# EAGLE design untitled (EAGLE 6.1)
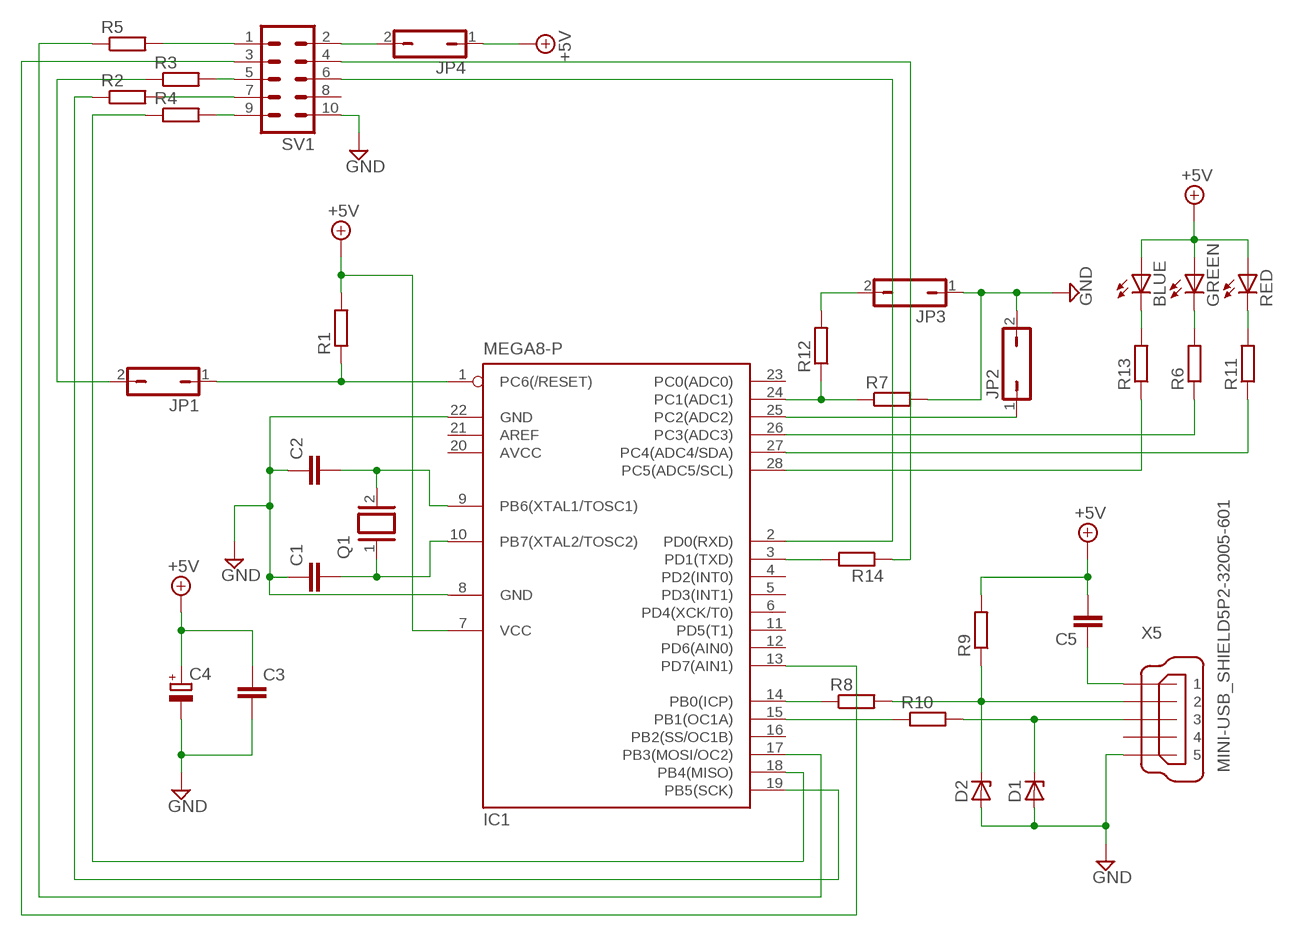
[diagram p0: schematic, sheet 1]

## Parts
BLUE  LED5MM  [LED5MM]
C1  C-EU025-025X050  [C025-025X050]
C2  C-EU025-025X050  [C025-025X050]
C3  C-EU025_050-025X075  [C025_050-025X075]
C4  CPOL-EUE2.5-5  [E2,5-5]
C5  C-EU025_050-025X075  [C025_050-025X075]
D1  ZENER-DIODEZD-5  [ZDIO-5]
D2  ZENER-DIODEZD-2.5  [ZDIO-2.5]
GREEN  LED5MM  [LED5MM]
IC1  MEGA8-P  [DIL28-3]
JP1  JP1Q  [JP1]
JP2  JP1Q  [JP1]
JP3  JP1Q  [JP1]
JP4  JP1Q  [JP1]
Q1  XTAL/S  [QS]
R1  R-EU_0207/2V  [0207/2V]
R2  R-EU_0207/2V  [0207/2V]
R3  R-EU_0207/2V  [0207/2V]
R4  R-EU_0207/2V  [0207/2V]
R5  R-EU_0207/2V  [0207/2V]
R6  R-EU_0204/5  [0204/5]
R7  R-EU_0204/5  [0204/5]
R8  R-EU_0207/2V  [0207/2V]
R9  R-EU_0207/2V  [0207/2V]
R10  R-EU_0207/2V  [0207/2V]
R11  R-EU_0204/5  [0204/5]
R12  R-EU_0204/5  [0204/5]
R13  R-EU_0204/5  [0204/5]
R14  R-EU_0207/2V  [0207/2V]
RED  LED5MM  [LED5MM]
SV1  ML10  [ML10]
X5  MINI-USB_SHIELD5P2-32005-601  [32005-601]

## Nets
+5V: BLUE.A C3.1 C4.+ C5.2 GREEN.A IC1.7(VCC) JP4.1 R1.2 R9.2 RED.A
D+: D1.C R10.2 X5.3
D-: D2.C R8.2 R9.1 X5.2
GND: C1.1 C2.1 C3.2 C4.- D1.A D2.A IC1.8(GND) IC1.22(GND) JP2.2 JP3.1 R7.2 SV1.10 X5.5
MISO: IC1.18(PB4(MISO)) R4.1
MOSI: IC1.17(PB3(MOSI/OC2)) R5.1
N$1: IC1.14(PB0(ICP)) R8.1
N$2: IC1.15(PB1(OC1A)) R10.1
N$3: IC1.24(PC1(ADC1)) R7.1 R12.1
N$4: JP3.2 R12.2
N$5: IC1.25(PC2(ADC2)) JP2.1
N$6: C5.1 X5.1
N$7: C2.2 IC1.9(PB6(XTAL1/TOSC1)) Q1.2
N$8: C1.2 IC1.10(PB7(XTAL2/TOSC2)) Q1.1
N$9: IC1.13(PD7(AIN1)) SV1.3
N$10: BLUE.K(C) R13.2
N$11: JP4.2 SV1.2
N$12: R11.2 RED.K(C)
N$13: R5.2 SV1.1
N$14: R3.2 SV1.5
N$15: R2.2 SV1.7
N$16: R4.2 SV1.9
N$17: IC1.3(PD1(TXD)) R14.2
N$19: GREEN.K(C) R6.2
N$20: JP1.2 R3.1
N$23: IC1.28(PC5(ADC5/SCL)) R13.1
N$24: IC1.26(PC3(ADC3)) R6.1
N$25: IC1.27(PC4(ADC4/SDA)) R11.1
RESET: IC1.1(PC6(/RESET)) JP1.1 R1.1
RX: IC1.2(PD0(RXD)) SV1.6
SCK: IC1.19(PB5(SCK)) R2.1
TX: R14.1 SV1.4
Unconnected: IC1.4(PD2(INT0)) IC1.5(PD3(INT1)) IC1.6(PD4(XCK/T0)) IC1.11(PD5(T1)) IC1.12(PD6(AIN0)) IC1.16(PB2(SS/OC1B)) IC1.21(AREF) IC1.23(PC0(ADC0)) SV1.8 X5.4 X5.M1(S1) X5.M2(S2)

## Power pins joined to a net without a drawn wire
AVCC: IC1.20(AVCC)

## Library data of the parts
BLUE GREEN RED = led:LED: LED OSRAM: - CHIPLED LG R971, LG N971, LY N971, LG Q971, LY Q971, LO R971, LY R971 LH N974, LH R974 LS Q976, LO Q976, LY Q976 LO Q996 - Hyper CHIPLED LW Q18S LB Q993, LB Q99A, LB R99A - SideLED LS A670, LO A670, LY A670, LG A670, LP A670 LB A673, LV A673, LT A673, LW A673 LH A674 LY A675 LS A676, LA A676, LO A676, LY A676, LW A676 LS A679, LY A679, LG A679 - Hyper Micro SIDELED® LS Y876, LA Y876, LO Y876, LY Y876 LT Y87S - SmartLED LW L88C, LW L88S LB L89C, LB L89S, LG L890 LS L89K, LO L89K, LY L89K LS L896, LA L896, LO L896, LY L896 - TOPLED LS T670, LO T670, LY T670, LG T670, LP T670 LSG T670, LSP T670, LSY T670, LOP T670, LYG T670 LG T671, LOG T671, LSG T671 LB T673, LV T673, LT T673, LW T673 LH T674 LS T676, LA T676, LO T676, LY T676, LB T676, LH T676, LSB T676, LW T676 LB T67C, LV T67C, LT T67C, LS T67K, LO T67K, LY T67K, LW E67C LS E67B, LA E67B, LO E67B, LY E67B, LB E67C, LV E67C, LT E67C LW T67C LS T679, LY T679, LG T679 LS T770, LO T770, LY T770, LG T770, LP T770 LB T773, LV T773, LT T773, LW T773 LH T774 LS E675, LA E675, LY E675, LS T675 LS T776, LA T776, LO T776, LY T776, LB T776 LHGB T686 LT T68C, LB T68C - Hyper Mini TOPLED® LB M676 - Mini TOPLED Santana® LG M470 LS M47K, LO M47K, LY M47K Source: http://www.osram.convergy.de LUXEON: - LUMILED® LXK2-PW12-R00, LXK2-PW12-S00, LXK2-PW14-U00, LXK2-PW14-V00 LXK2-PM12-R00, LXK2-PM12-S00, LXK2-PM14-U00 LXK2-PE12-Q00, LXK2-PE12-R00, LXK2-PE12-S00, LXK2-PE14-T00, LXK2-PE14-U00 LXK2-PB12-K00, LXK2-PB12-L00, LXK2-PB12-M00, LXK2-PB14-N00, LXK2-PB14-P00, LXK2-PB14-Q00 LXK2-PR12-L00, LXK2-PR12-M00, LXK2-PR14-Q00, LXK2-PR14-R00 LXK2-PD12-Q00, LXK2-PD12-R00, LXK2-PD12-S00 LXK2-PH12-R00, LXK2-PH12-S00 LXK2-PL12-P00, LXK2-PL12-Q00, LXK2-PL12-R00 Source: www.luxeon.com KINGBRIGHT: KA-3528ASYC Source: www.kingbright.com
C1-C3 C5 = rcl:C-EU: CAPACITOR, European symbol
C4 = rcl:CPOL-EU: POLARIZED CAPACITOR, European symbol
D1 D2 = diode:ZENER-DIODE: Z-Diode
IC1 = atmel:MEGA8-P: MICROCONTROLLER 8 Kbytes FLASH, 1 kbytes SRAM, 512 bytes EEPROM, USART, 4-channel 10 bit ADC, 2-channel 8 bit ADC Pin compatible with Atmega48, ATMega88, ATMega168 Source: avr.lbr; OC_FARNELL: unknown; OC_NEWARK: unknown
JP1-JP4 = jumper:JP1Q: JUMPER
Q1 = special:XTAL/S: CRYSTAL
R1-R14 = rcl:R-EU_: RESISTOR, European symbol
SV1 = con-ml:ML10: HARTING; OC_FARNELL: unknown; OC_NEWARK: unknown
X5 = con-cypressindustries:MINI-USB_SHIELD5P2-: MINI USB-B R/A DIP 5pol. Source: www.cypressindustries.com; OC_FARNELL: unknown; OC_NEWARK: unknown

## Board
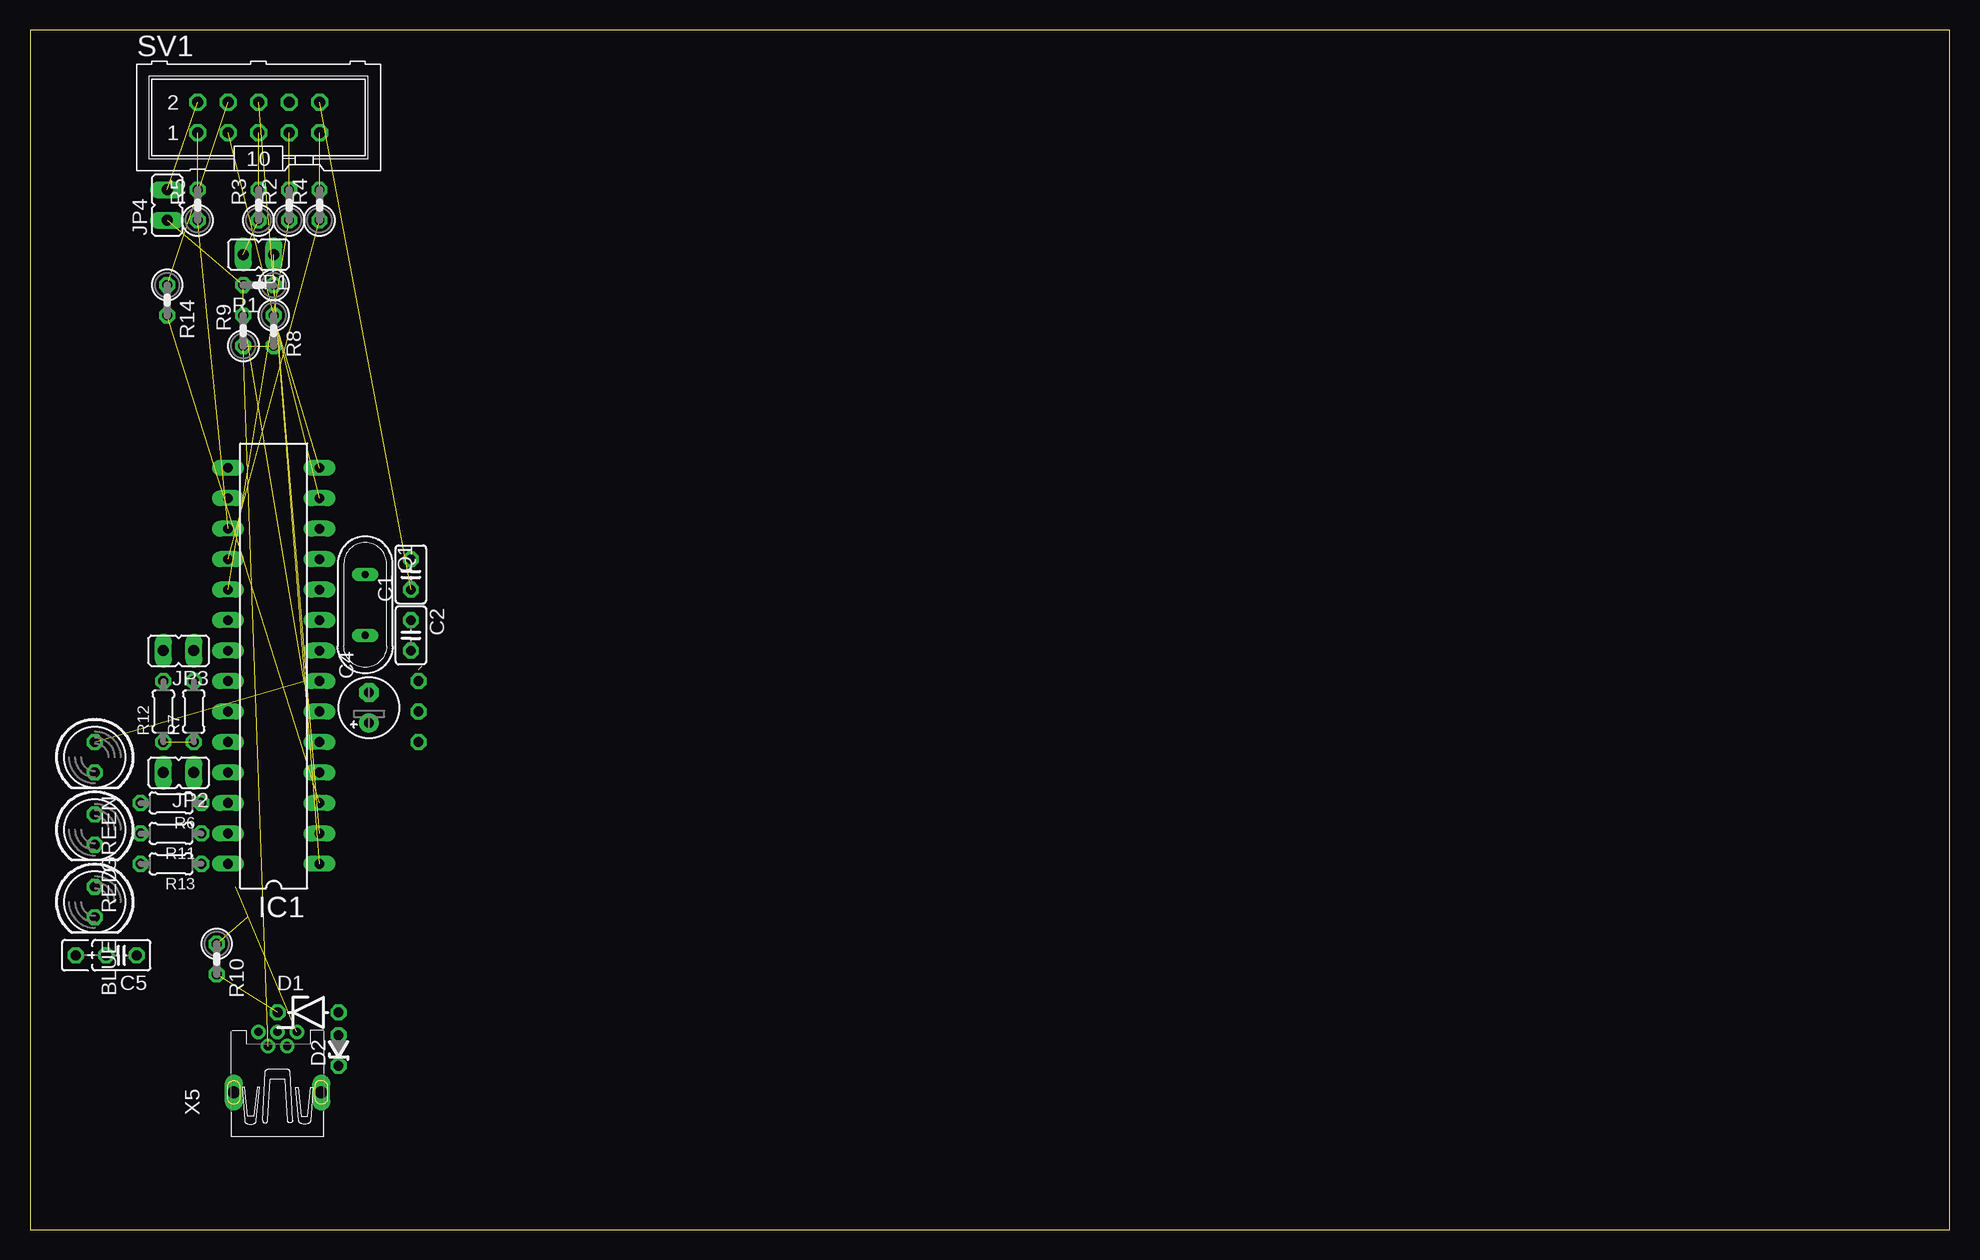
[diagram p1: board, top side]
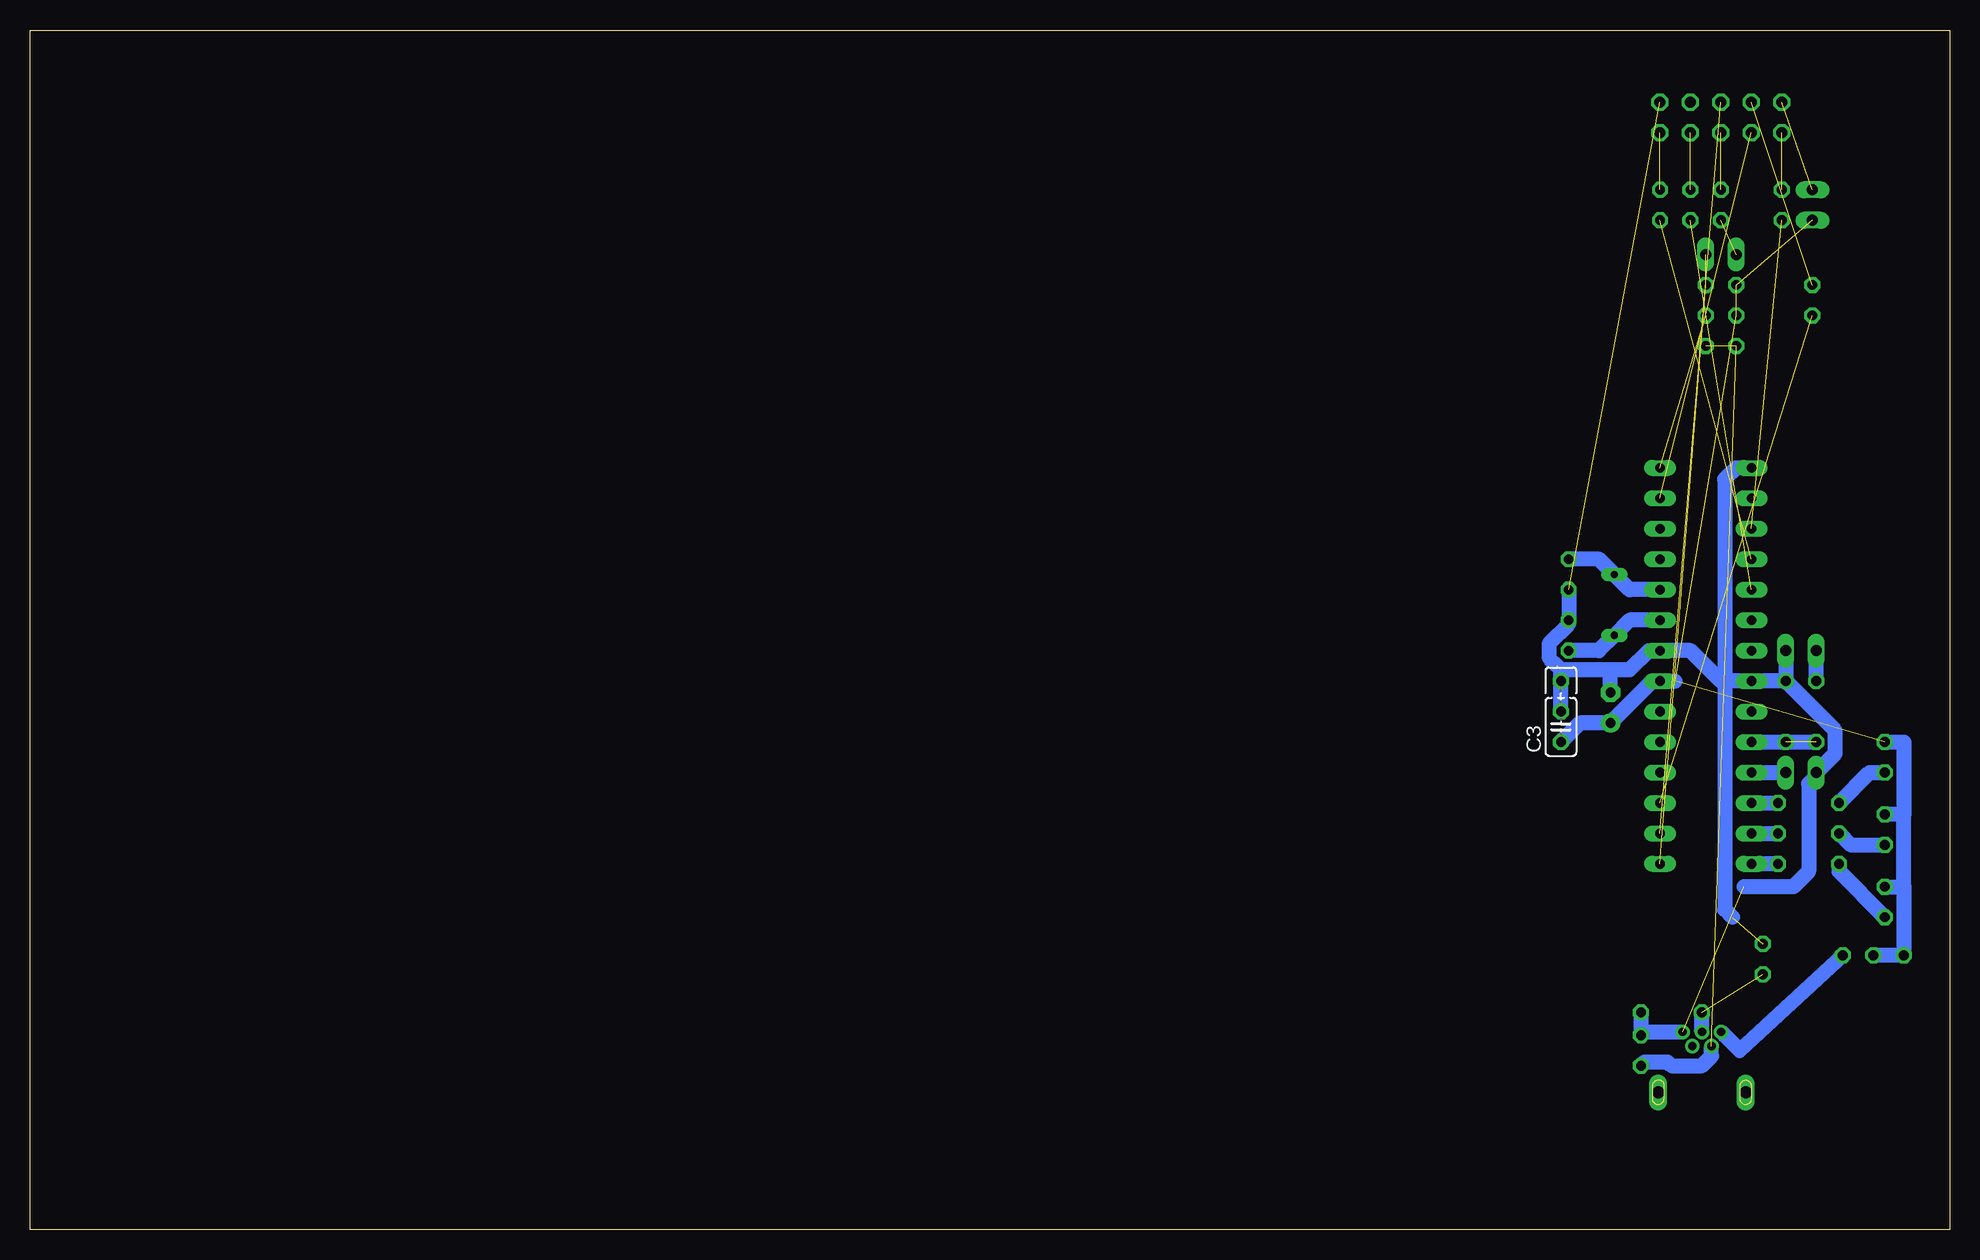
[diagram p2: board, bottom side, seen from below]

Size 160 x 100 mm. Coordinates in mm from the lower left corner, seen from the top.
Outline: 0,0 160,0 160,100 0,100 0,0
Copper layers (1*16): Top 0.035mm / dielectric 1.5mm / Bottom 0.035mm
Design rules: minimum track width 10mil, minimum drill 24mil, track to track 8mil, track to pad 8mil, pad to pad 8mil, via to via 8mil, smd to smd 8mil, copper to edge 40mil, drill to drill 8mil, minimum pad ring 10mil, minimum via ring 8mil, stop-mask expansion 4mil, vias tented up to drill 0mil, thermal gap 10mil

### Footprints (pad centres in the part's own frame; a part is rotated, then mirrored left to right if it is on the bottom)
LED5MM = drill 0.813 octagon: A -1.27,0; K 1.27,0
C025-025X050 = drill 0.813 octagon: 1 -1.27,0; 2 1.27,0
C025_050-025X075 = drill 0.813 octagon: 1 -1.27,0; 2 1.27,0; 3 3.81,0
E2,5-5 = drill 0.813 pad 1.6: + -1.27,0 | drill 0.813 pad 1.6 octagon: - 1.27,0
ZDIO-5 = drill 0.813 octagon: A 2.54,0; C -2.54,0
ZDIO-2.5 = drill 0.813 octagon: A 1.27,0; C -1.27,0
DIL28-3 = drill 0.813 long: 1 -16.51,-3.81; 2 -13.97,-3.81; 3 -11.43,-3.81; 4 -8.89,-3.81; 5 -6.35,-3.81; 6 -3.81,-3.81; 7 -1.27,-3.81; 8 1.27,-3.81; 9 3.81,-3.81; 10 6.35,-3.81; 11 8.89,-3.81; 12 11.43,-3.81; 13 13.97,-3.81; 14 16.51,-3.81; 15 16.51,3.81; 16 13.97,3.81; 17 11.43,3.81; 18 8.89,3.81; 19 6.35,3.81; 20 3.81,3.81; 21 1.27,3.81; 22 -1.27,3.81; 23 -3.81,3.81; 24 -6.35,3.81; 25 -8.89,3.81; 26 -11.43,3.81; 27 -13.97,3.81; 28 -16.51,3.81
JP1 = drill 0.914 long: 1 0,-1.27; 2 0,1.27
QS = drill 0.61 long: 1 -2.54,0; 2 2.54,0
0207/2V = drill 0.813 octagon: 1 -1.27,0; 2 1.27,0
0204/5 = drill 0.813 octagon: 1 -2.54,0; 2 2.54,0
ML10 = drill 0.914 octagon: 1 -5.08,-1.27; 2 -5.08,1.27; 3 -2.54,-1.27; 4 -2.54,1.27; 5 0,-1.27; 6 0,1.27; 7 2.54,-1.27; 8 2.54,1.27; 9 5.08,-1.27; 10 5.08,1.27
32005-601 = drill 0.7 pad 1.016: 1 2.825,1.6; 2 1.625,0.8; 3 2.825,0; 4 1.625,-0.8; 5 2.825,-1.6 | drill 1 pad 1.422 long: M1 -2.225,3.65; M2 -2.225,-3.65

### Placement (x,y rotation side)
BLUE  5.4,27.3 270 top
C1  31.75,54.61 90 top
C2  31.75,49.53 270 top
C3  32.38,41.91 90 bottom
C4  28.26,43.5 90 top
C5  7.62,22.86 180 top
D1  23.18,18.1 0 top
D2  25.72,14.92 90 top
GREEN  5.4,39.37 270 top
IC1  20.32,46.99 90 top
JP1  19.05,81.28 90 top
JP2  12.38,38.1 90 top
JP3  12.38,48.26 90 top
JP4  11.43,85.41 0 top
Q1  27.94,52.07 270 top
R1  19.05,78.74 180 top
R2  21.59,85.41 90 top
R3  19.05,85.41 90 top
R4  24.13,85.41 90 top
R5  13.97,85.41 90 top
R6  11.75,35.56 180 top
R7  13.65,43.18 90 top
R8  20.32,74.93 270 top
R9  17.78,74.93 90 top
R10  15.56,22.54 270 top
R11  11.75,33.02 180 top
R12  11.11,43.18 90 top
R13  11.75,30.48 180 top
R14  11.43,77.47 270 top
RED  5.4,33.34 270 top
SV1  19.05,92.71 0 top
X5  20.64,13.65 90 top

### Tracks (layer width: path | path; a pad name or v marks a point on that pad's centre or on a via)
+5V  (4 unrouted)
  Bottom 1.27: 22.86,45.72 IC1.7 24.77,45.72 C4.+ 30.8,42.23 C3.1 | 3.81,28.57 3.81,34.61 | 3.81,34.61 3.81,40.64 GREEN.A | 3.81,34.61 RED.A | BLUE.A 3.81,28.57 | 3.81,28.57 3.81,22.86 C5.2
D+  (1 unrouted)
  Bottom 1.27: X5.3 D1.C
D-  (2 unrouted)
  Bottom 1.27: D2.C 25.4,13.97 23.5,13.97 23.18,13.65 20.64,13.65 19.84,14.45 X5.2
GND  (3 unrouted)
  Bottom 1.27: JP3.1 R7.2 | R7.2 9.53,41.59 9.53,39.69 JP2.2 11.11,37.78 11.75,37.15 11.75,29.84 13.02,28.57 17.14,28.57 | R7.2 IC1.22 19.05,45.72 21.59,48.26 IC1.8 | C1.1 C2.1 31.75,50.48 33.34,48.9 33.34,47.62 32.7,46.99 | IC1.8 24.77,48.26 | C3.2 32.38,46.67 28.26,46.67 | 28.26,46.67 26.67,46.67 25.08,48.26 IC1.8 | C4.- 28.26,46.67 | D2.A 25.72,16.51 | D1.A 25.72,16.51 | 25.72,16.51 25.68,16.48 X5.5
MISO  (1 unrouted)
MOSI  (1 unrouted)
N$1  (1 unrouted)
N$2  (1 unrouted)
  Bottom 1.27: IC1.15 17.78,63.5 18.73,62.55 18.73,26.67 18.1,26.04
N$3  (1 unrouted)
  Bottom 1.27: IC1.24 R12.1
N$4
  Bottom 1.27: R12.2 JP3.2
N$5
  Bottom 1.27: IC1.25 JP2.1
N$6
  Bottom 1.27: C5.1 17.48,14.92 X5.1
N$7
  Bottom 1.27: IC1.9 26.67,50.8 Q1.2 29.21,48.26 C2.2
N$8
  Bottom 1.27: IC1.10 26.67,53.34 Q1.1 29.21,55.88 C1.2
N$9  (1 unrouted)
N$10
  Bottom 1.27: BLUE.K 9.21,29.84 R13.2
N$11  (1 unrouted)
N$12
  Bottom 1.27: R11.2 8.26,32.07 RED.K
N$13  (1 unrouted)
N$14  (1 unrouted)
N$15  (1 unrouted)
N$16  (1 unrouted)
N$17  (1 unrouted)
N$19
  Bottom 1.27: R6.2 6.67,38.1 GREEN.K
N$20  (1 unrouted)
N$23
  Bottom 1.27: R13.1 IC1.28
N$24
  Bottom 1.27: IC1.26 R6.1
N$25
  Bottom 1.27: IC1.27 R11.1
RESET  (2 unrouted)
RX  (1 unrouted)
SCK  (1 unrouted)
TX  (1 unrouted)